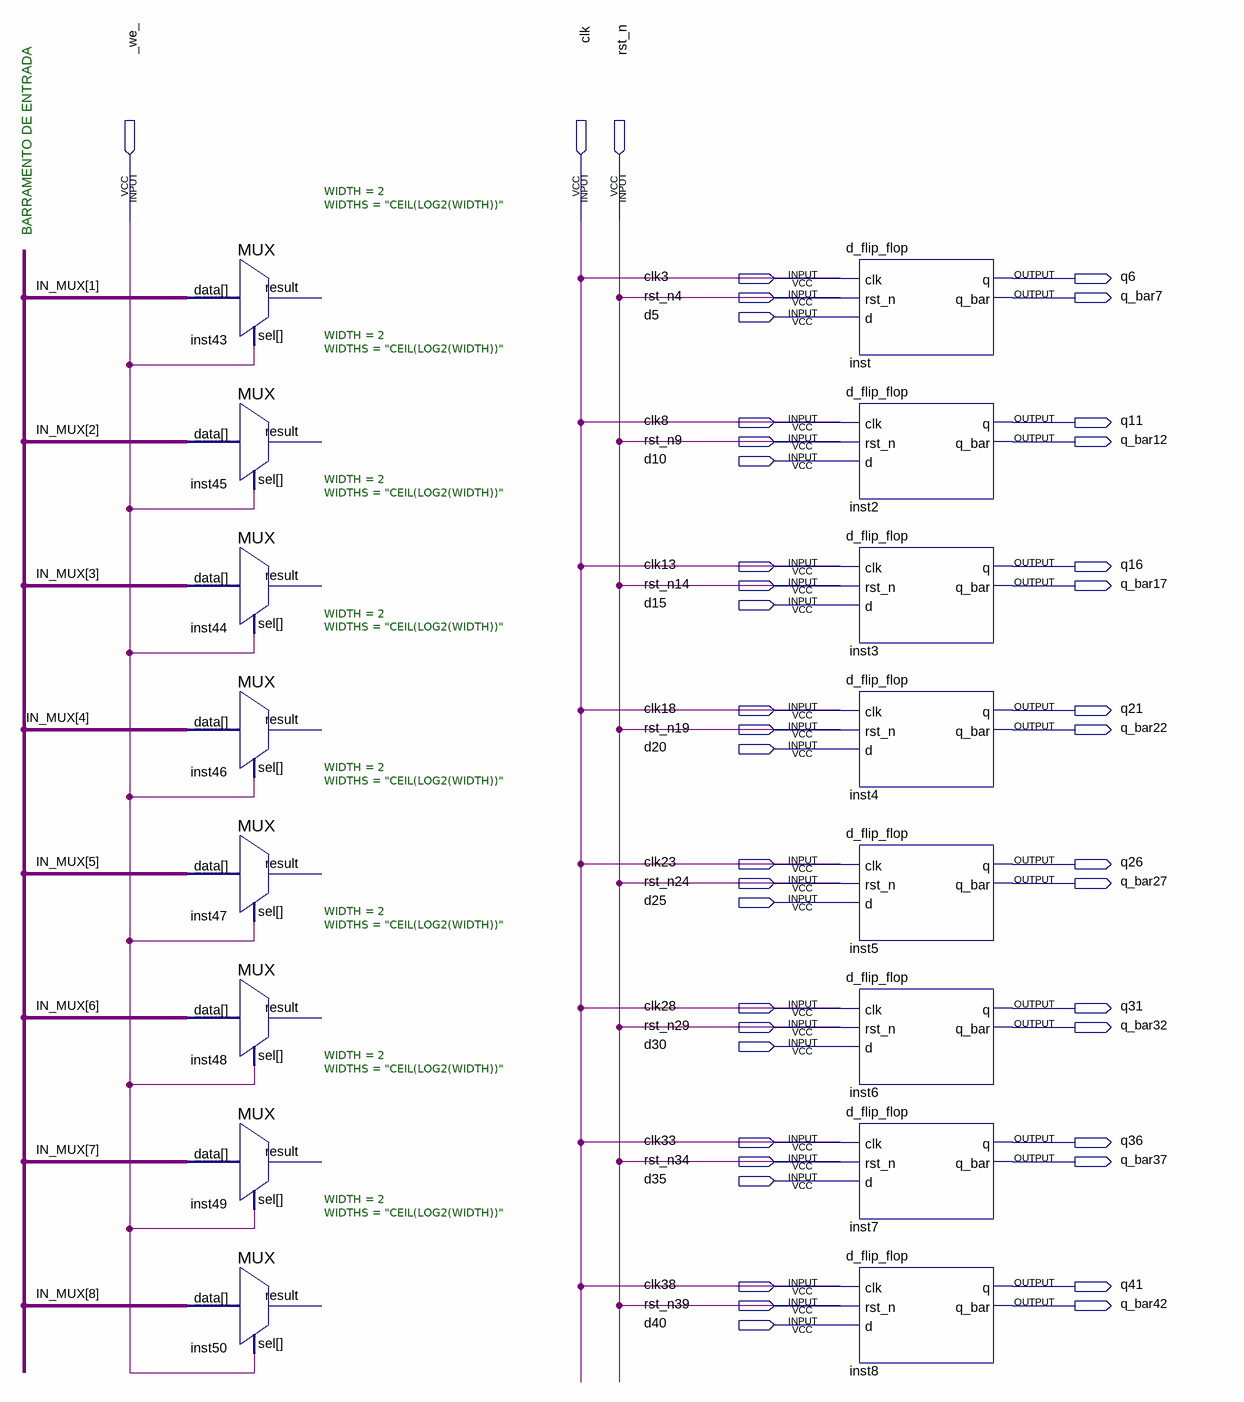
[diagram p0: schematic sheet]
// Quartus schematic esquematico.bdf as structural Verilog: 16 symbols, 43 pins
module esquematico (
  input  _we_,
  input  clk,
  input  rst_n,
  input  clk3,
  input  rst_n4,
  input  d5,
  input  clk8,
  input  rst_n9,
  input  d10,
  input  clk13,
  input  rst_n14,
  input  d15,
  input  clk18,
  input  rst_n19,
  input  d20,
  input  clk23,
  input  rst_n24,
  input  d25,
  input  clk28,
  input  rst_n29,
  input  d30,
  input  clk33,
  input  rst_n34,
  input  d35,
  input  clk38,
  input  rst_n39,
  input  d40,
  output q6,
  output q_bar7,
  output q11,
  output q_bar12,
  output q16,
  output q_bar17,
  output q21,
  output q_bar22,
  output q26,
  output q_bar27,
  output q31,
  output q_bar32,
  output q36,
  output q_bar37,
  output q41,
  output q_bar42
);

  wire [8:1] IN_MUX;

  MUX #(.WIDTH(2), .WIDTHS("CEIL(LOG2(WIDTH))")) inst43 (.data({2{IN_MUX[1]}}), .sel(_we_));  // open: result
  MUX #(.WIDTH(2), .WIDTHS("CEIL(LOG2(WIDTH))")) inst45 (.data({2{IN_MUX[2]}}), .sel(_we_));  // open: result
  MUX #(.WIDTH(2), .WIDTHS("CEIL(LOG2(WIDTH))")) inst44 (.data({2{IN_MUX[3]}}), .sel(_we_));  // open: result
  MUX #(.WIDTH(2), .WIDTHS("CEIL(LOG2(WIDTH))")) inst46 (.data({2{IN_MUX[4]}}), .sel(_we_));  // open: result
  MUX #(.WIDTH(2), .WIDTHS("CEIL(LOG2(WIDTH))")) inst47 (.data({2{IN_MUX[5]}}), .sel(_we_));  // open: result
  MUX #(.WIDTH(2), .WIDTHS("CEIL(LOG2(WIDTH))")) inst48 (.data({2{IN_MUX[6]}}), .sel(_we_));  // open: result
  MUX #(.WIDTH(2), .WIDTHS("CEIL(LOG2(WIDTH))")) inst49 (.data({2{IN_MUX[7]}}), .sel(_we_));  // open: result
  MUX #(.WIDTH(2), .WIDTHS("CEIL(LOG2(WIDTH))")) inst50 (.data({2{IN_MUX[8]}}), .sel(_we_));  // open: result
  d_flip_flop inst (.clk(clk), .rst_n(rst_n), .d(d5), .q(q6), .q_bar(q_bar7));
  d_flip_flop inst2 (.clk(clk), .rst_n(rst_n), .d(d10), .q(q11), .q_bar(q_bar12));
  d_flip_flop inst3 (.clk(clk), .rst_n(rst_n), .d(d15), .q(q16), .q_bar(q_bar17));
  d_flip_flop inst4 (.clk(clk), .rst_n(rst_n), .d(d20), .q(q21), .q_bar(q_bar22));
  d_flip_flop inst5 (.clk(clk), .rst_n(rst_n), .d(d25), .q(q26), .q_bar(q_bar27));
  d_flip_flop inst6 (.clk(clk), .rst_n(rst_n), .d(d30), .q(q31), .q_bar(q_bar32));
  d_flip_flop inst7 (.clk(clk), .rst_n(rst_n), .d(d35), .q(q36), .q_bar(q_bar37));
  d_flip_flop inst8 (.clk(clk), .rst_n(rst_n), .d(d40), .q(q41), .q_bar(q_bar42));

  assign clk3 = clk;
  assign clk8 = clk;
  assign clk13 = clk;
  assign clk18 = clk;
  assign clk23 = clk;
  assign clk28 = clk;
  assign clk33 = clk;
  assign clk38 = clk;
  assign rst_n4 = rst_n;
  assign rst_n9 = rst_n;
  assign rst_n14 = rst_n;
  assign rst_n19 = rst_n;
  assign rst_n24 = rst_n;
  assign rst_n29 = rst_n;
  assign rst_n34 = rst_n;
  assign rst_n39 = rst_n;

  // Notes on the sheet:
  //   BARRAMENTO DE ENTRADA
endmodule
